# EAGLE design cubey (EAGLE 8.7.1)
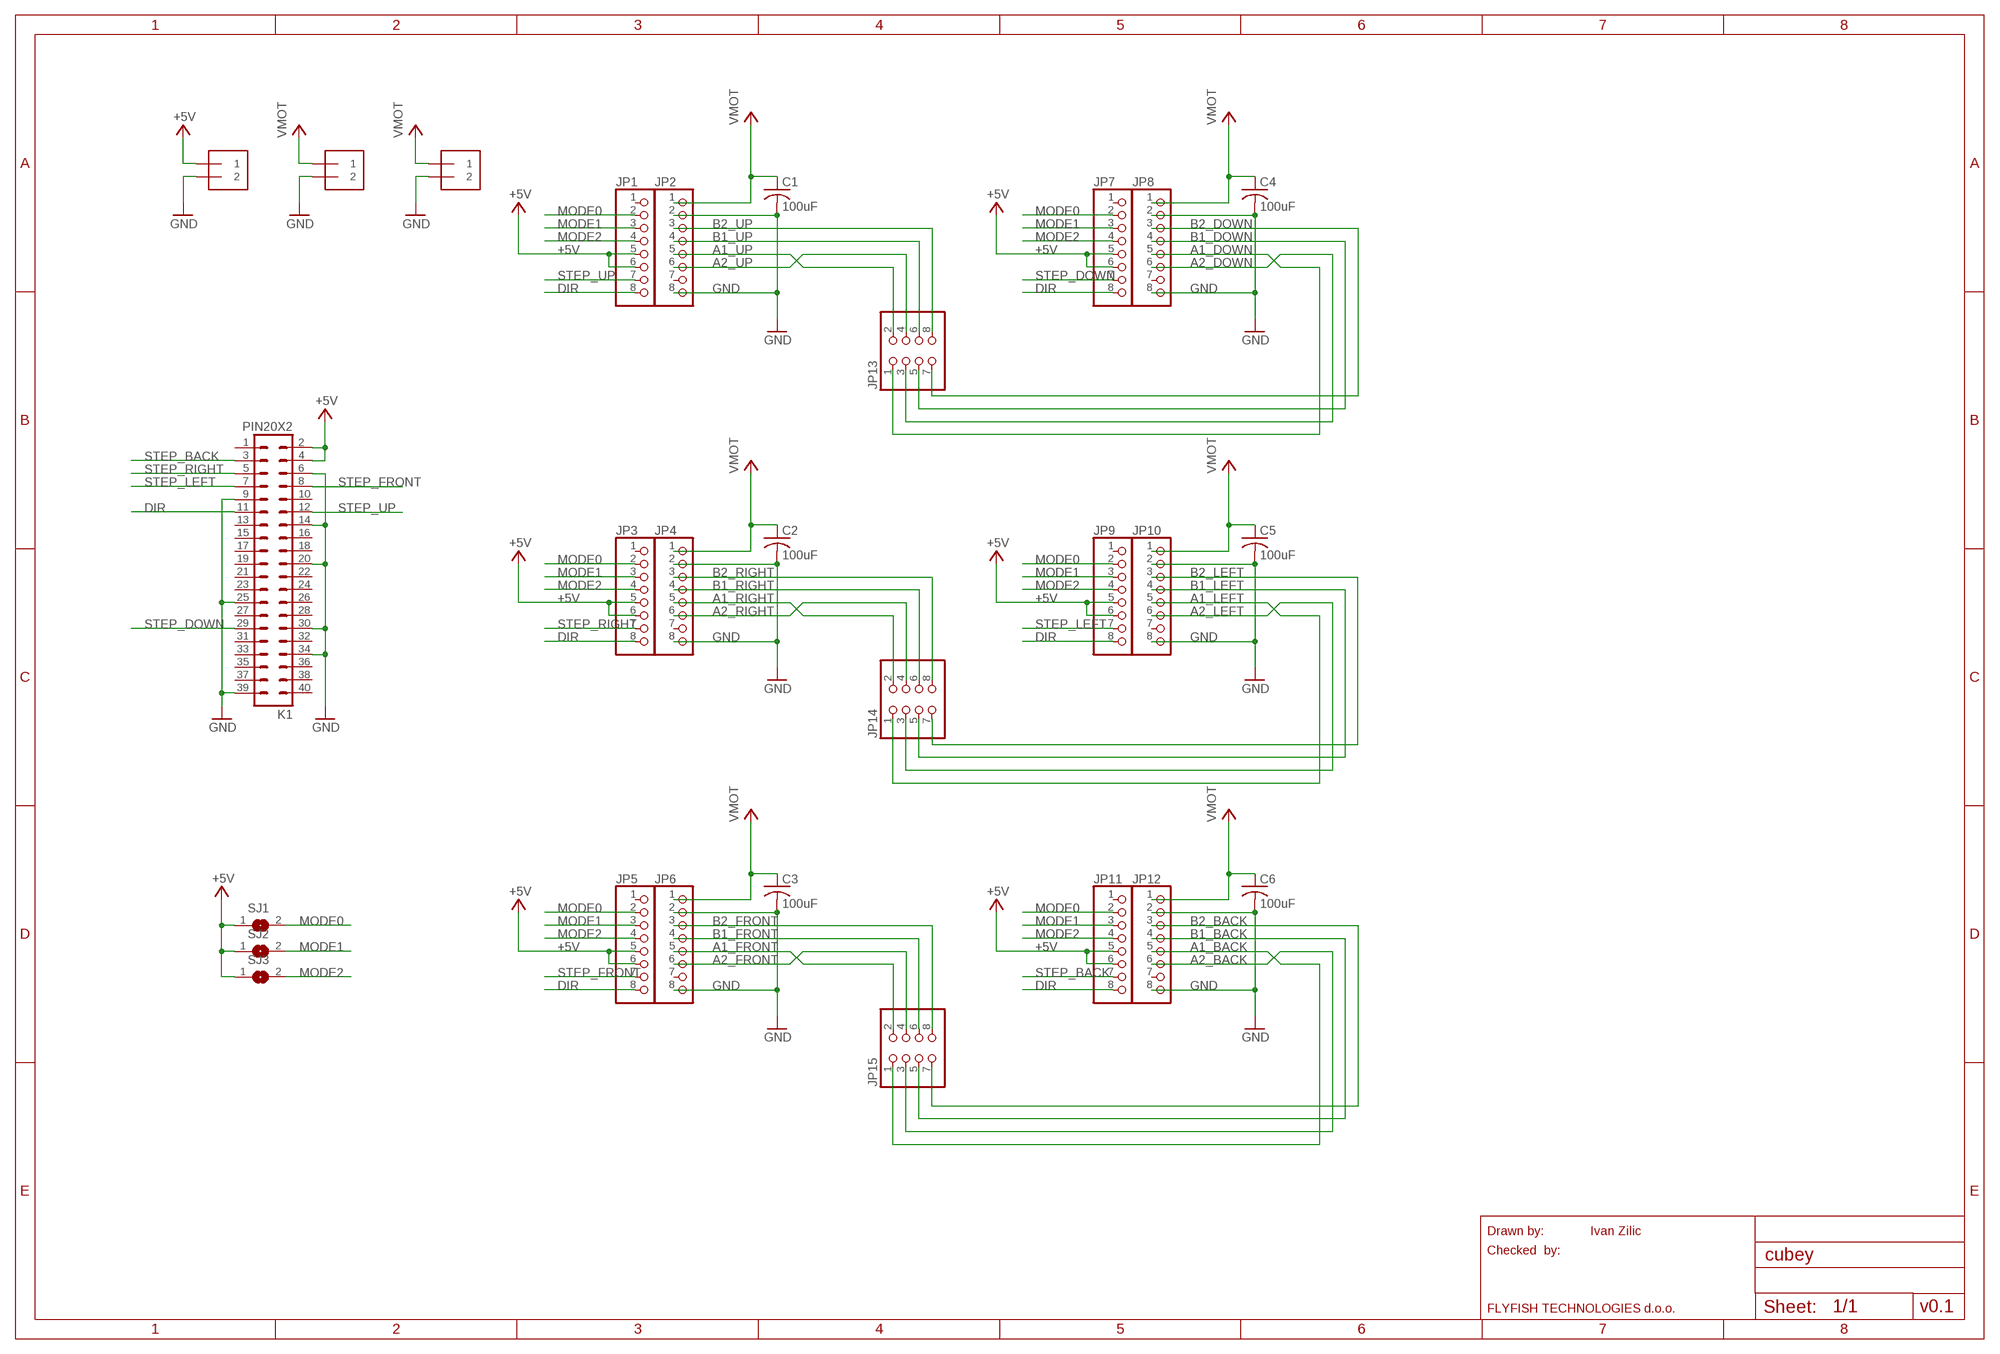
[diagram p0: schematic, sheet 1]

## Parts
5V_PWR  1X2-3.5MM  [1X2-3.5MM]
C1  100uF  C-US025-025X050  [C025-025X050]
C2  100uF  C-US025-025X050  [C025-025X050]
C3  100uF  C-US025-025X050  [C025-025X050]
C4  100uF  C-US025-025X050  [C025-025X050]
C5  100uF  C-US025-025X050  [C025-025X050]
C6  100uF  C-US025-025X050  [C025-025X050]
JP1  PINHD-1X8  [1X08]
JP2  PINHD-1X8  [1X08]
JP3  PINHD-1X8  [1X08]
JP4  PINHD-1X8  [1X08]
JP5  PINHD-1X8  [1X08]
JP6  PINHD-1X8  [1X08]
JP7  PINHD-1X8  [1X08]
JP8  PINHD-1X8  [1X08]
JP9  PINHD-1X8  [1X08]
JP10  PINHD-1X8  [1X08]
JP11  PINHD-1X8  [1X08]
JP12  PINHD-1X8  [1X08]
JP13  PINHD-2X4  [2X04]
JP14  PINHD-2X4  [2X04]
JP15  PINHD-2X4  [2X04]
K1  PIN20X2  [PIN_20X2]
MOT_PWR  1X2-3.5MM  [1X2-3.5MM]
MOT_PWR1  1X2-3.5MM  [1X2-3.5MM]
SJ1  SJ  [SJ]
SJ2  SJ  [SJ]
SJ3  SJ  [SJ]

## Nets
+5V: 5V_PWR.1 JP1.5 JP1.6 JP3.5 JP3.6 JP5.5 JP5.6 JP7.5 JP7.6 JP9.5 JP9.6 JP11.5 JP11.6 K1.2 K1.4 SJ1.1 SJ2.1 SJ3.1
A1_BACK: JP12.5 JP15.1
A1_DOWN: JP8.5 JP13.1
A1_FRONT: JP6.5 JP15.2
A1_LEFT: JP10.5 JP14.1
A1_RIGHT: JP4.5 JP14.2
A1_UP: JP2.5 JP13.2
A2_BACK: JP12.6 JP15.3
A2_DOWN: JP8.6 JP13.3
A2_FRONT: JP6.6 JP15.4
A2_LEFT: JP10.6 JP14.3
A2_RIGHT: JP4.6 JP14.4
A2_UP: JP2.6 JP13.4
B1_BACK: JP12.4 JP15.5
B1_DOWN: JP8.4 JP13.5
B1_FRONT: JP6.4 JP15.6
B1_LEFT: JP10.4 JP14.5
B1_RIGHT: JP4.4 JP14.6
B1_UP: JP2.4 JP13.6
B2_BACK: JP12.3 JP15.7
B2_DOWN: JP8.3 JP13.7
B2_FRONT: JP6.3 JP15.8
B2_LEFT: JP10.3 JP14.7
B2_RIGHT: JP4.3 JP14.8
B2_UP: JP2.3 JP13.8
DIR: JP1.8 JP3.8 JP5.8 JP7.8 JP9.8 JP11.8 K1.11
GND: 5V_PWR.2 C1.2 C2.2 C3.2 C4.2 C5.2 C6.2 JP2.2 JP2.8 JP4.2 JP4.8 JP6.2 JP6.8 JP8.2 JP8.8 JP10.2 JP10.8 JP12.2 JP12.8 K1.6 K1.9 K1.14 K1.20 K1.25 K1.30 K1.34 K1.39 MOT_PWR1.2 MOT_PWR.2
MODE0: JP1.2 JP3.2 JP5.2 JP7.2 JP9.2 JP11.2 SJ1.2
MODE1: JP1.3 JP3.3 JP5.3 JP7.3 JP9.3 JP11.3 SJ2.2
MODE2: JP1.4 JP3.4 JP5.4 JP7.4 JP9.4 JP11.4 SJ3.2
STEP_BACK: JP11.7 K1.3
STEP_DOWN: JP7.7 K1.29
STEP_FRONT: JP5.7 K1.8
STEP_LEFT: JP9.7 K1.7
STEP_RIGHT: JP3.7 K1.5
STEP_UP: JP1.7 K1.12
VCC: C1.1 C2.1 C3.1 C4.1 C5.1 C6.1 JP2.1 JP4.1 JP6.1 JP8.1 JP10.1 JP12.1 MOT_PWR1.1 MOT_PWR.1 ; supply symbol labelled VMOT
Unconnected: JP1.1 JP2.7 JP3.1 JP4.7 JP5.1 JP6.7 JP7.1 JP8.7 JP9.1 JP10.7 JP11.1 JP12.7 K1.1 K1.10 K1.13 K1.15 K1.16 K1.17 K1.18 K1.19 K1.21 K1.22 K1.23 K1.24 K1.26 K1.27 K1.28 K1.31 K1.32 K1.33 K1.35 K1.36 K1.37 K1.38 K1.40

## Notes on the sheet
- Drawn by: | Ivan Zilic
- Checked  by:
- FLYFISH TECHNOLOGIES d.o.o. | v0.1

## Library data of the parts
5V_PWR MOT_PWR MOT_PWR1 = adafruit:1X2: 3.5mm Terminal block http://www.ladyada.net/library/pcb/eaglelibrary.html
C1-C6 = rcl:C-US: CAPACITOR, American symbol; SPICEPREFIX: C
JP1-JP12 = pinhead:PINHD-1X8: PIN HEADER
JP13-JP15 = pinhead:PINHD-2X4: PIN HEADER
K1 = FLYFISH:PIN20X2
SJ1-SJ3 = jumper:SJ: SMD solder JUMPER

## Net classes
0 default: width 0.406 mm, clearance 0.203 mm

## Board
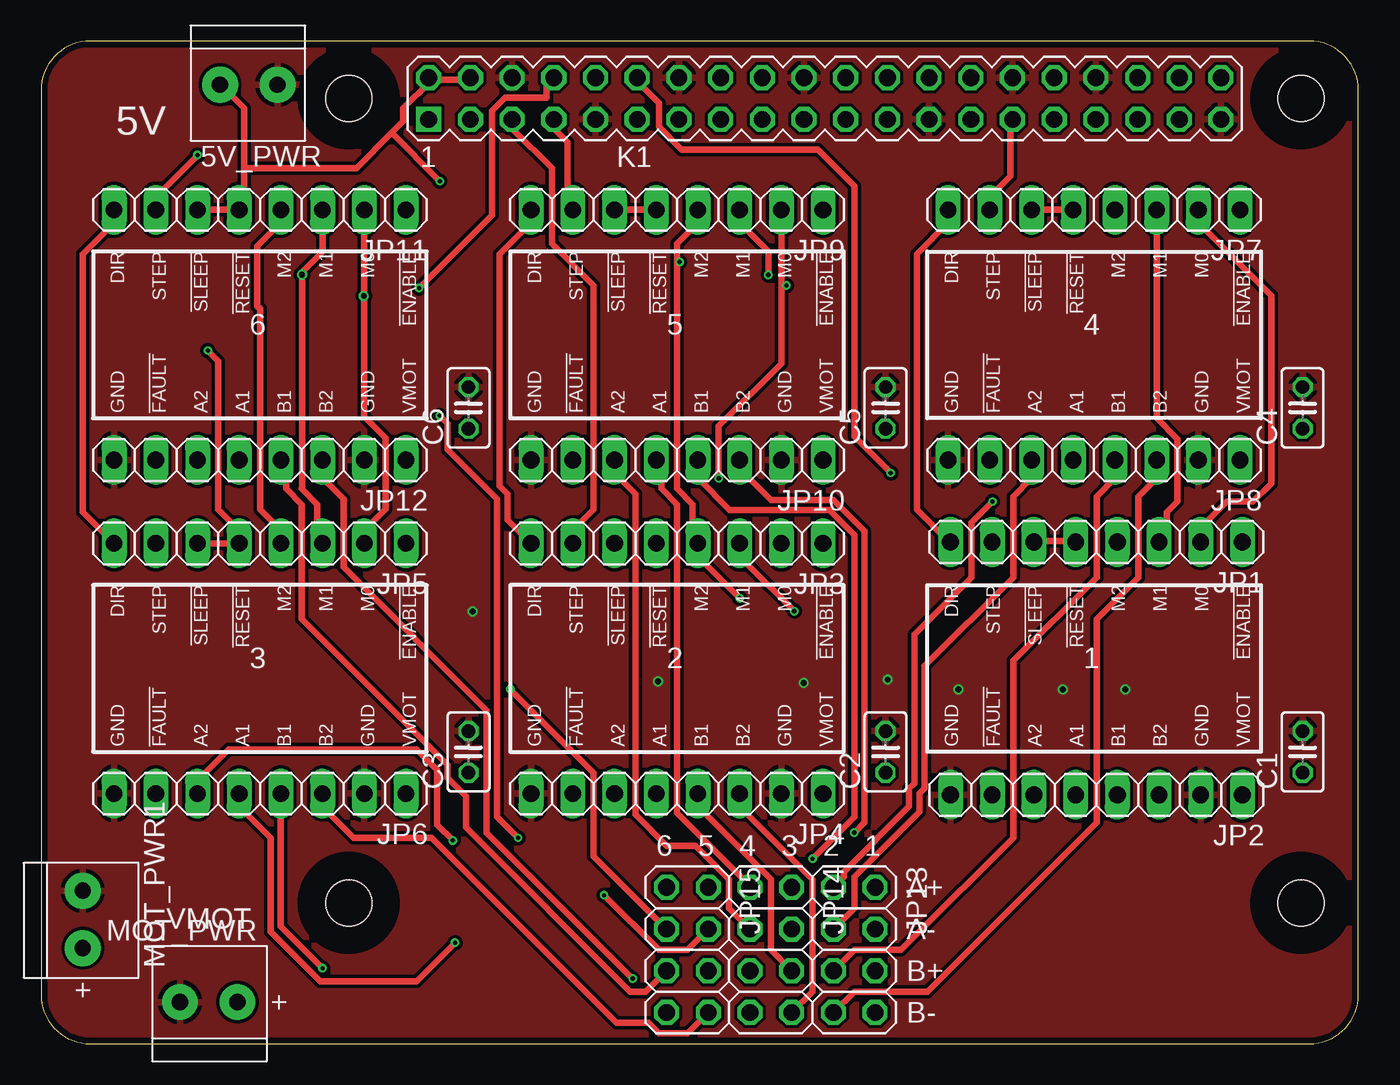
[diagram p1: board, top side]
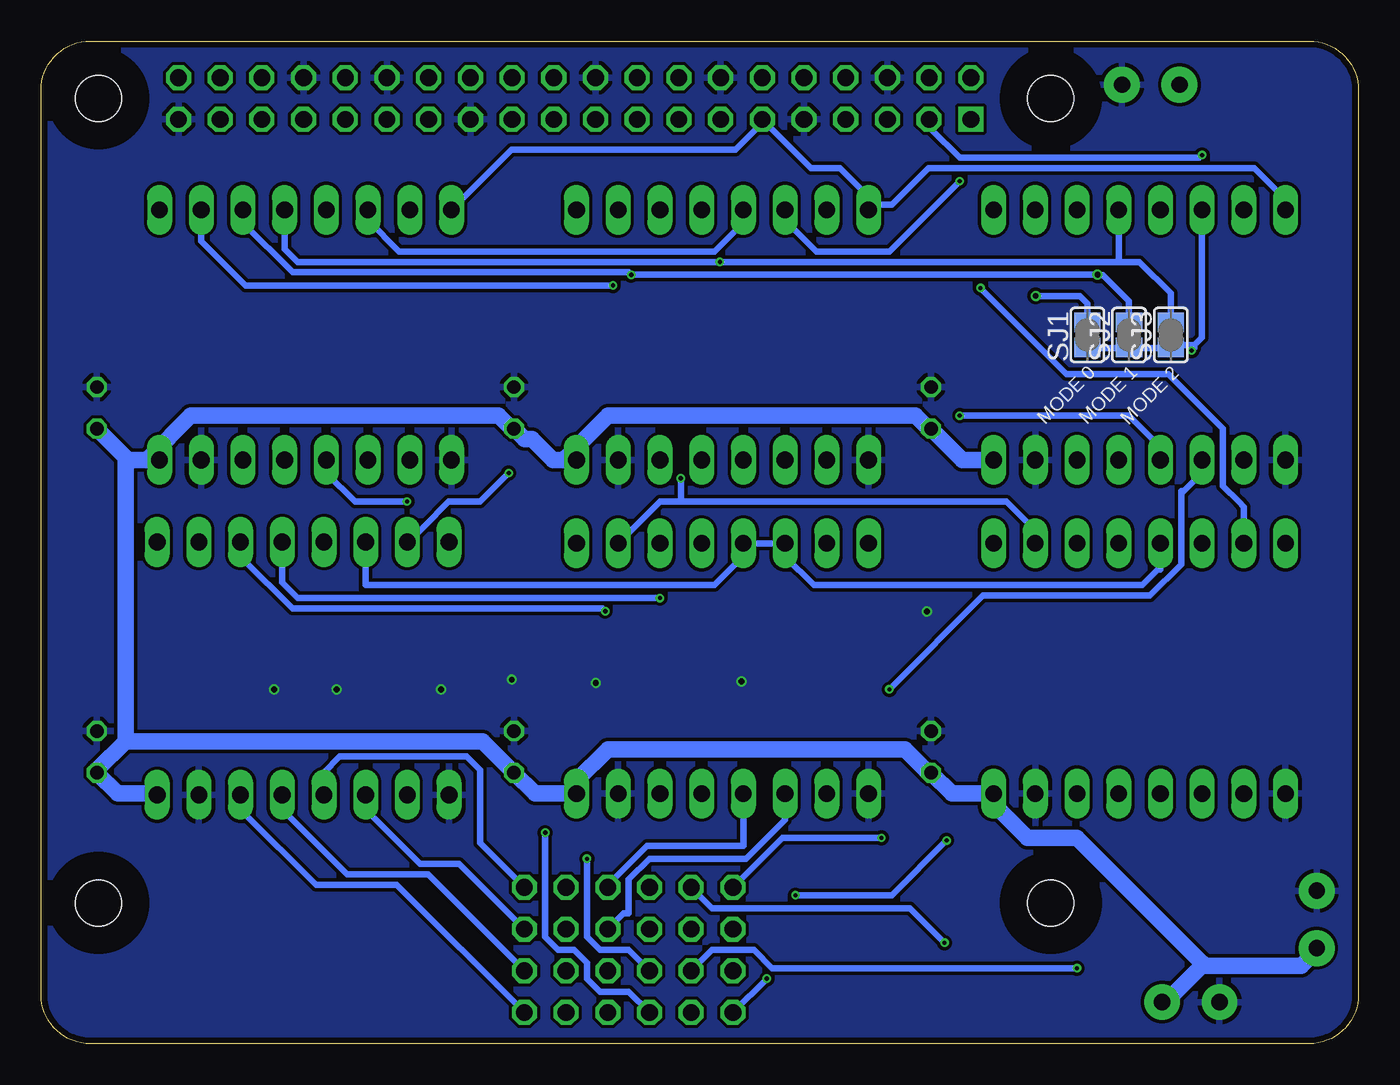
[diagram p2: board, bottom side, seen from below]

Size 80.24 x 61.08 mm. Coordinates in mm from the lower left corner, seen from the top.
Outline: 0,3 arc90 3,0 77.24,0 arc90 80.24,3 80.24,58.08 arc90 77.24,61.08 3,61.08 arc90 0,58.08 0,3
Copper layers (1*16): Top 0.035559375mm / dielectric 1.6mm / Bottom 0.035559375mm
Design rules "oshpark-2layer": minimum track width 6mil, minimum drill 10mil, track to track 6mil, track to pad 6mil, pad to pad 6mil, via to via 6mil, smd to smd 6mil, copper to edge 15mil, drill to drill 6mil, minimum pad ring 5mil, minimum via ring 5mil, stop-mask expansion 2.5mil, vias tented up to drill 0mil, thermal gap 10mil
Holes 2.8 mm at 18.74,8.58 18.74,57.58 76.74,57.58 76.74,8.58
tRestrict: area 17.2,56 to 20.3,59.1; area 75.2,56 to 78.3,59.1; area 75.2,7 to 78.3,10.1; area 17.2,7 to 20.3,10.1
bRestrict: area 17.2,7 to 20.3,10.1; area 17.2,56 to 20.3,59.1; area 75.2,7 to 78.3,10.1; area 75.2,56 to 78.3,59.1

### Footprints (pad centres in the part's own frame; a part is rotated, then mirrored left to right if it is on the bottom)
1X2-3.5MM = drill 1 pad 2.184: 1 1.8,0; 2 -1.7,0
C025-025X050 = drill 0.813 octagon: 1 -1.27,0; 2 1.27,0
1X08 = drill 1.016 long: 1 -8.89,0; 2 -6.35,0; 3 -3.81,0; 4 -1.27,0; 5 1.27,0; 6 3.81,0; 7 6.35,0; 8 8.89,0
2X04 = drill 1.016 octagon: 1 -3.81,-1.27; 2 -3.81,1.27; 3 -1.27,-1.27; 4 -1.27,1.27; 5 1.27,-1.27; 6 1.27,1.27; 7 3.81,-1.27; 8 3.81,1.27
PIN_20X2 = drill 1.016 square: 1 -24.13,-1.27 | drill 1.016 octagon: 2 -24.13,1.27; 3 -21.59,-1.27; 4 -21.59,1.27; 5 -19.05,-1.27; 6 -19.05,1.27; 7 -16.51,-1.27; 8 -16.51,1.27; 9 -13.97,-1.27; 10 -13.97,1.27; 11 -11.43,-1.27; 12 -11.43,1.27; 13 -8.89,-1.27; 14 -8.89,1.27; 15 -6.35,-1.27; 16 -6.35,1.27; 17 -3.81,-1.27; 18 -3.81,1.27; 19 -1.27,-1.27; 20 -1.27,1.27; 21 1.27,-1.27; 22 1.27,1.27; 23 3.81,-1.27; 24 3.81,1.27; 25 6.35,-1.27; 26 6.35,1.27; 27 8.89,-1.27; 28 8.89,1.27; 29 11.43,-1.27; 30 11.43,1.27; 31 13.97,-1.27; 32 13.97,1.27; 33 16.51,-1.27; 34 16.51,1.27; 35 19.05,-1.27; 36 19.05,1.27; 37 21.59,-1.27; 38 21.59,1.27; 39 24.13,-1.27; 40 24.13,1.27
SJ = smd 1.168 x 1.6: 1 -0.762,0; 2 0.762,0

### Placement (x,y rotation side)
5V_PWR  12.7,58.42 180 top
C1  76.83,17.78 90 top
C2  51.44,17.78 90 top
C3  26.04,17.78 90 top
C4  76.83,38.73 90 top
C5  51.44,38.73 90 top
C6  26.04,38.73 90 top
JP1  64.28,30.57 180 top
JP2  64.28,15.16 180 top
JP3  38.73,30.48 180 top
JP4  38.73,15.24 180 top
JP5  13.34,30.48 180 top
JP6  13.34,15.24 180 top
JP7  64.14,50.8 180 top
JP8  64.14,35.56 180 top
JP9  38.73,50.8 180 top
JP10  38.73,35.56 180 top
JP11  13.34,50.8 180 top
JP12  13.34,35.56 180 top
JP13  49.53,5.71 270 top
JP14  44.45,5.71 270 top
JP15  39.37,5.71 270 top
K1  47.74,57.58 0 top
MOT_PWR  10.16,2.54 0 top
MOT_PWR1  2.54,7.62 270 top
SJ1  16.51,43.18 90 bottom
SJ2  13.97,43.18 90 bottom
SJ3  11.43,43.18 90 bottom

### Tracks (layer width: path | path; a pad name or v marks a point on that pad's centre or on a via)
+5V  (via drill 0.25)
  Top 0.406: JP1.6 60.48,30.64 62.87,30.64 JP1.5 | JP5.6 JP5.5 11.59,30.64 11.59,31.75 10.79,32.54 10.79,41.59 v10.16,42.23 | JP7.5 JP7.6 | JP9.5 JP9.6 | K1.4 26.04,58.74 23.65,58.74 K1.2 23.65,58.58 22.07,56.99 22.07,56.2 21.35,55.48 | JP11.6 JP11.5 12.06,51.91 12.38,52.23 12.38,53.34 | 21.35,55.48 19.21,53.34 12.38,53.34 | 21.35,55.48 v24.29,52.55 | 12.38,53.34 12.38,56.99 10.95,58.42 5V_PWR.1
  Bottom 0.406: JP3.5 | JP3.5 JP3.6 34.92,29.69 33.18,27.94 13.18,27.94 12.22,28.89 12.06,28.89 JP5.5 | JP1.6 60.48,30.48 60.48,27.94 39.21,27.94 37.45,29.7 JP3.5 | SJ1.1 16.51,42.39 14.13,42.39 SJ2.1 13.97,42.39 11.43,42.39 SJ3.1 11.27,42.55 10,42.55 | 10,42.55 9.53,43.02 JP11.6 | JP9.6 34.92,50.16 33.02,48.26 28.57,48.26 v24.29,52.55 | JP7.6 60.33,50.16 58.42,48.26 39.21,48.26 37.47,50.01 JP9.5 | 10,42.55 10,42.39 v10.16,42.23
A1_BACK  (via drill 0.25)
  Top 0.406: v29.05,12.54 27.78,13.81 27.78,33.18 24.77,36.2 24.77,37.78 v24.29,38.26
  Bottom 0.406: JP15.1 35.08,12.54 v29.05,12.54 | v24.29,38.26 13.97,38.26 12.06,36.35 JP12.5
A1_DOWN  (via drill 0.25)
  Top 0.406: JP13.1 48.9,10.16 48.9,10.48 52.86,14.45 52.86,15.56 53.18,15.88 53.18,24.92 56.67,28.42 56.67,31.75 v57.95,33.03
  Bottom 0.406: JP8.5 62.87,34.77 61.12,33.02 v57.96,33.02 v57.95,33.03
A1_FRONT  (via drill 0.25)
  Top 0.406: JP6.5 12.54,14.76 12.54,13.97 13.97,12.54 13.97,6.83 16.99,3.81 22.86,3.81 v25.21,6.16
  Bottom 0.406: v25.21,6.16 27.3,8.26 39.37,8.26 JP15.2
A1_LEFT
  Top 0.406: JP10.5 37.47,34.45 37.78,34.13 37.78,33.81 38.73,32.86 38.73,14.06 39.1,13.7 39.44,13.36 43.18,9.62 JP14.1
A1_RIGHT
  Bottom 0.406: JP4.5 37.47,12.06 43.34,12.06 45.72,9.68 JP14.2
A1_UP
  Bottom 0.406: JP13.2 53.5,12.22 53.5,16.67 54.33,17.5 62.05,17.5 63.01,16.55 JP2.5
A2_BACK  (via drill 0.25)
  Top 0.406: JP15.3 33.66,11.43 33.66,16.51 v28.57,21.59
  Bottom 0.406: v28.57,21.59 22.86,27.3 12.7,27.3 10.79,29.21 10.79,33.66 10.64,33.66 9.53,34.77 JP12.6
A2_DOWN
  Top 0.406: JP13.3 49.53,8.26 49.53,10.16 53.5,14.13 53.5,15.24 53.82,15.56 53.82,23.02 59.21,28.42 59.21,33.34 60.33,34.45 JP8.6
A2_FRONT  (via drill 0.25)
  Top 0.406: JP6.6 10,15.72 10,16.51 11.43,17.94 22.86,17.94 24.13,16.67 24.13,13.34 v25.08,12.38 | v34.29,9.05 37.62,5.71 39.37,5.71 39.69,6.03 JP15.4
  Bottom 0.406: v25.08,12.38 28.42,9.05 v34.29,9.05
A2_LEFT
  Top 0.406: JP14.3 41.91,8.26 41.91,10 39.85,12.06 38.1,12.06 36.2,13.97 36.2,33.5 34.92,34.77 JP10.6
A2_RIGHT
  Bottom 0.406: JP4.6 34.92,13.65 37.31,11.27 43.18,11.27 44.45,10 44.45,7.94 44.77,7.94 JP14.4
A2_UP
  Bottom 0.406: JP13.4 54.77,10.95 57.15,10.95 60.33,14.13 60.33,15.08 JP2.6
B1_BACK
  Top 0.406: JP15.5 36.83,3.17 35.88,3.17 25.88,13.18 25.88,15.08 24.77,16.19 24.77,16.99 15.88,25.88 15.88,32.86 14.92,33.81 14.92,34.13 14.61,34.45 JP12.4
B1_DOWN
  Top 0.406: JP13.5 49.53,5.71 52.39,5.71 53.02,6.35 59.21,12.54 59.21,23.34 64.29,28.42 64.29,33.34 65.41,34.45 JP8.4
B1_FRONT  (via drill 0.25)
  Top 0.406: JP6.4 14.61,7.14 v17.14,4.6
  Bottom 0.406: v17.14,4.6 35.72,4.6 36.83,5.71 39.37,5.71 JP15.6
B1_LEFT  (via drill 0.25)
  Top 0.406: v46.99,11.27 49.53,13.81 49.53,30.99 48.01,32.51 41.94,32.51 40.01,34.45 JP10.4
  Bottom 0.406: JP14.5 44.45,5.71 46.2,5.71 46.99,6.51 v46.99,11.27
B1_RIGHT
  Top 0.406: JP14.6 44.45,5.71 44.45,10 40.01,14.45 JP4.4
B1_UP
  Bottom 0.406: JP13.6 56.67,10.32 61.59,10.32 65.41,14.13 65.41,15.08 JP2.4
B2_BACK  (via drill 0.25)
  Top 0.406: v36.04,3.97 27.15,12.86 27.15,20.32 18.41,29.05 18.41,33.18 17.14,34.45 JP12.3
  Bottom 0.406: v36.04,3.97 JP15.7
B2_DOWN
  Top 0.406: JP13.7 49.53,3.17 53.98,3.17 64.29,13.49 64.29,25.88 66.83,28.42 66.83,33.34 67.94,34.45 JP8.3
B2_FRONT
  Top 0.406: JP6.3 17.62,14.76 17.62,13.97 19.05,12.54 23.78,12.54 35.05,1.27 36.99,1.27 37.62,0.64 39.37,0.64 JP15.8
B2_LEFT  (via drill 0.25)
  Top 0.406: v49.53,12.86 50.16,13.49 50.16,30.32 50.14,30.35 50.14,31.24 48.26,33.12 44.45,33.12 42.55,35.03 JP10.3
  Bottom 0.406: JP14.7 44.45,3.17 46.2,3.17 46.99,3.97 46.99,4.92 47.62,5.56 47.78,5.71 48.74,5.71 49.53,6.51 v49.53,12.86
B2_RIGHT
  Top 0.406: JP14.8 46.99,3.17 46.99,10 42.55,14.45 JP4.3
B2_UP
  Bottom 0.406: JP13.8 58.58,9.68 63.5,9.68 67.94,14.13 67.94,15.08 JP2.3
DIR
  Top 0.406: JP5.8 2.54,32.38 2.54,48.1 4.45,50.01 JP11.8 | JP3.8 28.42,31.91 28.42,33.5 27.94,33.97 27.94,48.1 29.84,50.01 JP9.8 | JP7.8 55.24,50.01 53.34,48.1 53.34,32.54 55.24,30.64 JP1.8
  Bottom 0.406: JP7.8 51.59,54.45 37.94,54.45 36.35,56.04 36.2,56.04 K1.11 36.2,56.2 33.34,53.34 31.59,53.34 29.84,51.59 JP9.8 29.69,51.12 28.42,51.12 26.19,53.34 6.35,53.34 4.45,51.44 JP11.8
GND  (via drill 0.35)
  other vias: 46.45,21.98 51.56,22.18 55.88,21.59 62.23,21.59 66.04,21.59 26.29,26.33 37.57,22.07
  pour Top: -17.78,63.5 81.28,63.5 81.28,-1.27 -17.78,-1.27
  pour Bottom: -15.24,66.04 83.82,66.04 83.82,-2.54 -15.24,-2.54
MODE0  (via drill 0.25, 0.35)
  Top 0.406: JP7.2 70.96,50.32 70.96,49.53 74.93,45.56 74.93,34.13 73.82,33.02 72.23,33.02 70.64,31.43 70.64,30.64 JP1.2 | JP5.2 20.16,30.96 20.16,31.75 20.98,32.57 20.98,36.9 19.68,38.2 19.68,45.58 | 45.09,46.2 45.09,41.43 41.27,37.62 v41.27,34.45 | 45.09,46.2 JP9.2 | v45.4,46.2 45.09,46.2 | JP11.2 19.68,45.58 | 19.68,45.58 v19.66,45.55
  Bottom 0.406: SJ1.2 16.51,45.09 16.98,45.55 v19.66,45.55 | JP3.2 42.55,33.02 41.27,33.02 | JP5.2 19.68,31.27 21.43,33.02 41.27,33.02 | 41.27,33.02 v41.27,34.45 | v45.4,46.2 67.79,46.2 70.48,48.9 JP7.2
MODE1  (via drill 0.25, 0.35)
  Top 0.406: JP3.3 43.02,30 43.02,29.21 v45.88,26.35 | JP11.3 17.14,48.26 15.89,47.01 v15.89,46.84 15.89,33.83 15.88,33.81 16.83,32.86 16.83,30.8 JP5.3 | JP9.3 43.02,50.32 43.02,49.53 44.29,48.26 v44.29,46.83 | JP7.3 67.94,38.1 69.22,36.83 69.22,33.02 68.58,32.38 68.58,31.11 68.1,30.64 JP1.3
  Bottom 0.406: v45.88,26.35 46.04,26.51 64.93,26.51 67.94,29.53 67.94,30.48 JP1.3 | SJ2.2 13.97,45.24 15.56,46.83 15.88,46.83 v15.89,46.84 44.28,46.84 v44.29,46.83 44.45,46.99 64.93,46.99 67.94,50.01 JP7.3
MODE2  (via drill 0.25)
  Top 0.406: JP5.4 14.13,30.96 14.13,31.75 13.34,32.54 13.34,44.77 13.18,44.93 13.18,48.58 14.61,50.01 JP11.4 | 38.73,47.62 38.73,48.74 40.01,50.01 JP9.4 | 38.73,47.62 38.73,33.81 39.69,32.86 39.69,30.8 JP3.4 40.01,29.69 v42.55,27.15 | v38.89,47.62 38.73,47.62
  Bottom 0.406: 14.61,50.01 JP11.4 14.61,47.63 14.6,47.62 | JP7.4 65.41,48.42 64.61,47.62 v38.89,47.62 14.6,47.62 | v42.55,27.15 64.61,27.15 65.56,28.1 65.56,30.48 JP1.4 | 14.6,47.62 13.34,47.62 11.43,45.72 SJ3.2
STEP_BACK  (via drill 0.25)
  Top 0.406: JP11.7 7.46,51.28 7.46,52.07 v9.53,54.13
  Bottom 0.406: v9.53,54.13 9.68,53.98 24.29,53.98 26.04,55.72 26.04,56.2 K1.3
STEP_DOWN
  Top 0.406: K1.29 59.05,56.2 59.05,52.86 58.26,52.07 58.26,51.28 JP7.7
STEP_FRONT  (via drill 0.25)
  Top 0.406: v23.02,46.04 27.46,50.48 27.46,56.83 28.26,57.63 30.8,57.63 30.8,58.26 31.11,58.58 31.11,58.74 K1.8
  Bottom 0.406: JP5.7 6.99,32.7 7.3,33.02 8.26,33.97 8.26,37.47 11.59,40.8 17.78,40.8 v23.02,46.04
STEP_LEFT
  Top 0.406: JP9.7 32.07,51.12 32.07,54.93 31.27,55.72 31.27,56.2 K1.7
STEP_RIGHT
  Top 0.406: JP3.7 32.86,30.96 32.86,31.75 33.66,32.54 33.66,46.2 31.11,48.74 31.11,53.34 28.73,55.72 28.73,56.2 K1.5
STEP_UP  (via drill 0.25)
  Top 0.406: v51.75,34.77 49.53,36.99 49.53,52.23 47.31,54.45 39.02,54.45 37.62,55.85 37.62,57.31 36.35,58.58 36.35,58.74 K1.12
  Bottom 0.406: v51.75,34.77 53.5,33.02 55.4,33.02 56.91,31.51 57.78,30.64 JP1.7
VCC
  Bottom 0.406: MOT_PWR.1 11.75,2.54 | 2.54,5.71 MOT_PWR1.1 | 9.53,4.92 9.53,4.76 | 26.19,37.47 C6.1 | 48.26,35.72 JP10.1 | 73.18,15.24 JP2.1 | 75.09,35.4 74.93,35.4 74.93,35.56 | 76.83,16.67 C1.1 | 51.59,37.47 C5.1 | 73.66,35.72 JP8.1
  Bottom 1.016: 2.54,5.71 3.49,4.76 9.53,4.76 11.75,2.54 | 9.53,4.92 17.14,12.54 20.16,12.54 22.23,14.61 JP6.1 24.77,15.24 C3.1 26.19,16.51 27.62,17.94 45.72,17.94 47.62,16.03 JP4.1 50.16,15.24 C2.1 53.34,18.41 75.09,18.41 | JP12.1 24.13,35.56 C6.1 | C5.1 50.8,36.83 50.32,36.83 49.05,35.56 JP10.1 | 26.19,37.47 26.99,38.26 45.72,38.26 48.26,35.72 | C1.1 75.56,15.24 73.18,15.24 | C4.1 74.93,35.56 JP8.1 | 75.09,18.41 76.83,16.67 | 75.09,35.4 75.09,18.41 | 51.59,37.47 52.39,38.26 71.12,38.26 73.66,35.72

### Text on the board
tNames: 5V | DIR | STEP | !SLEEP | !RESET | M2 | M1 | M0 | !ENABLE | DIR | STEP | !SLEEP | !RESET | M2 | M1 | M0 | !ENABLE | DIR | STEP | !SLEEP | !RESET | M2 | M1 | M0 | !ENABLE | 6 | 5 | 4 | GND | !FAULT | A2 | A1 | B1 | B2 | GND | VMOT | GND | !FAULT | A2 | A1 | B1 | B2 | GND | VMOT | GND | !FAULT | A2 | A1 | B1 | B2 | GND | VMOT | DIR | STEP | !SLEEP | !RESET | M2 | M1 | M0 | !ENABLE | DIR | STEP | !SLEEP | !RESET | M2 | M1 | M0 | !ENABLE | DIR | STEP | !SLEEP | !RESET | M2 | M1 | M0 | !ENABLE | 3 | 2 | 1 | GND | !FAULT | A2 | A1 | B1 | B2 | GND | VMOT | GND | !FAULT | A2 | A1 | B1 | B2 | GND | VMOT | GND | !FAULT | A2 | A1 | B1 | B2 | GND | VMOT | 6 | 5 | 4 | 3 | 2 | 1 | A+ | VMOT | A- | + | B+ | + | B-
bNames: MODE 2 | MODE 1 | MODE 0